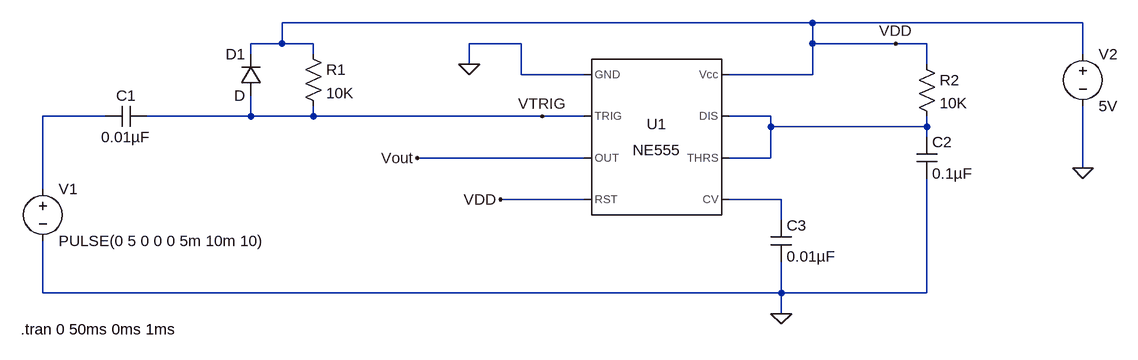
[diagram p0: schematic T6-Monostable Multivibrator.asc]
T6-Monostable Multivibrator.asc, the LTspice schematic file:
Version 4
SHEET 1 920 680
WIRE 448 -32 -368 -32
WIRE 864 -32 448 -32
WIRE -368 0 -368 -32
WIRE -368 0 -416 0
WIRE -320 0 -368 0
WIRE 0 0 -80 0
WIRE 448 0 448 -32
WIRE 576 0 448 0
WIRE 624 0 576 0
WIRE -416 16 -416 0
WIRE -320 16 -320 0
WIRE 864 16 864 -32
WIRE -80 32 -80 0
WIRE 624 32 624 0
WIRE 0 48 0 0
WIRE 96 48 0 48
WIRE 448 48 448 0
WIRE 448 48 320 48
WIRE -640 112 -736 112
WIRE -416 112 -416 80
WIRE -416 112 -576 112
WIRE -320 112 -320 96
WIRE -320 112 -416 112
WIRE 32 112 -320 112
WIRE 96 112 32 112
WIRE 384 112 320 112
WIRE 384 128 384 112
WIRE 624 128 624 112
WIRE 624 128 384 128
WIRE 624 144 624 128
WIRE 96 176 -160 176
WIRE 384 176 384 128
WIRE 384 176 320 176
WIRE 864 192 864 96
WIRE -736 224 -736 112
WIRE 96 240 -32 240
WIRE 400 240 320 240
WIRE 400 272 400 240
WIRE -736 384 -736 304
WIRE 400 384 400 336
WIRE 400 384 -736 384
WIRE 624 384 624 208
WIRE 624 384 400 384
WIRE 400 416 400 384
FLAG -80 32 0
FLAG 864 192 0
FLAG 400 416 0
FLAG 576 0 VDD
FLAG -32 240 VDD
FLAG -160 176 Vout
FLAG 32 112 VTRIG
SYMBOL Misc\\NE555 208 144 R0
SYMATTR InstName U1
SYMBOL res -336 0 R0
SYMATTR InstName R1
SYMATTR Value 10K
SYMBOL diode -400 80 R180
WINDOW 0 24 64 Left 2
WINDOW 3 24 0 Left 2
SYMATTR InstName D1
SYMBOL cap -576 96 R90
WINDOW 0 0 32 VBottom 2
WINDOW 3 32 32 VTop 2
SYMATTR InstName C1
SYMATTR Value 0.01µF
SYMBOL cap 608 144 R0
SYMATTR InstName C2
SYMATTR Value 0.1µF
SYMBOL res 608 16 R0
SYMATTR InstName R2
SYMATTR Value 10K
SYMBOL cap 384 272 R0
SYMATTR InstName C3
SYMATTR Value 0.01µF
SYMBOL voltage 864 0 R0
WINDOW 123 0 0 Left 0
WINDOW 39 0 0 Left 0
SYMATTR InstName V2
SYMATTR Value 5V
SYMBOL voltage -736 208 R0
WINDOW 123 0 0 Left 0
WINDOW 39 0 0 Left 0
SYMATTR InstName V1
SYMATTR Value PULSE(0 5 0 0 0 5m 10m 10)
TEXT -770 440 Left 2 !.tran 0 50ms 0ms 1ms

The netlist it stands for:
* T6-Monostable Multivibrator.asc
XU1 0 VTRIG Vout VDD N003 N002 N002 VDD NE555  ; pins GND TRIG OUT RST CV THRS DIS Vcc
R1 VDD VTRIG 10K
D1 VTRIG VDD D
C1 VTRIG N001 0.01µF
C2 N002 0 0.1µF
R2 VDD N002 10K
C3 N003 0 0.01µF
V2 VDD 0 5V
V1 N001 0 PULSE(0 5 0 0 0 5m 10m 10)
.model D D
.lib standard.dio
.tran 0 50ms 0ms 1ms
.lib NE555.sub
.backanno
.end